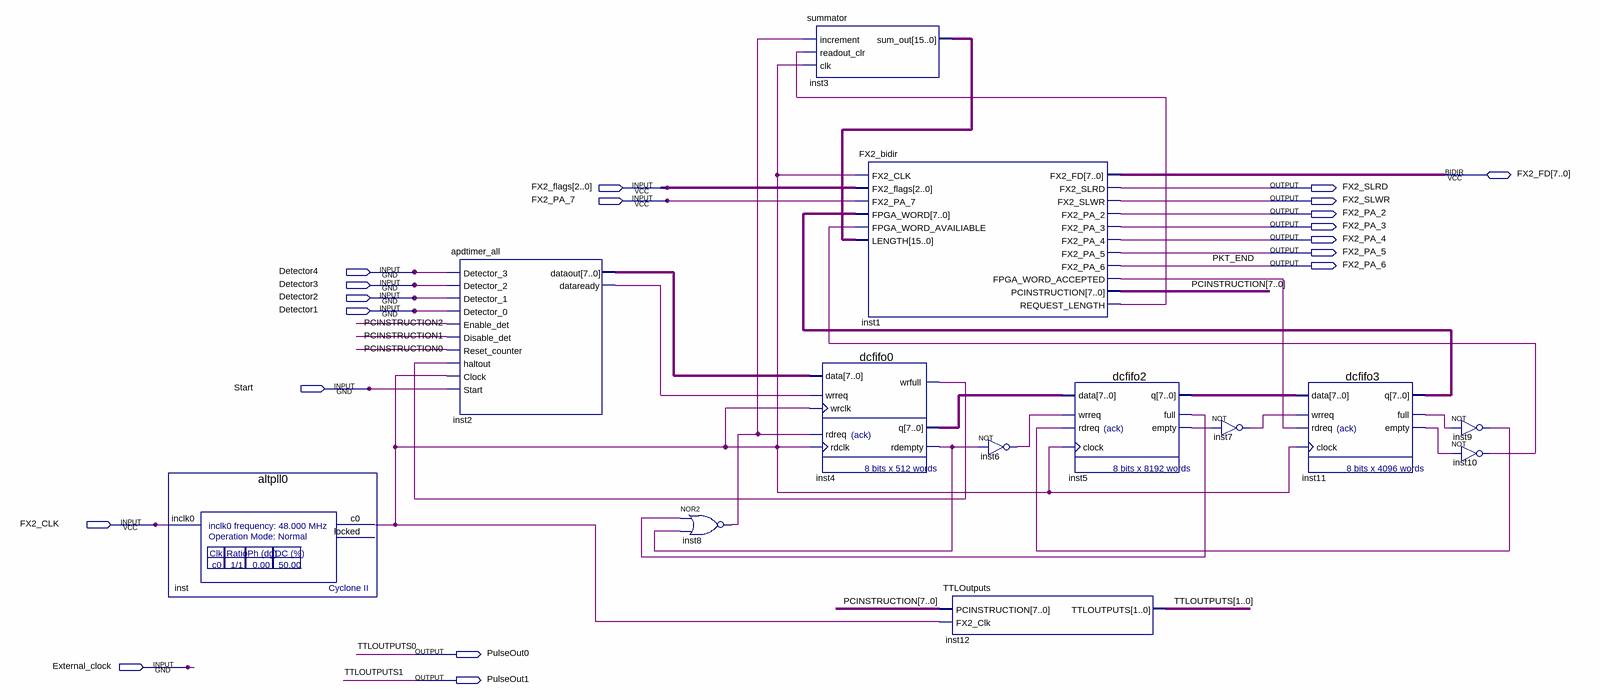
[diagram p0: schematic sheet]
// Quartus schematic testingigo_all.bdf as structural Verilog: 13 symbols, 19 pins
module testingigo_all (
  input  [2:0] FX2_flags,
  input  FX2_PA_7,
  input  Detector4,
  input  Detector3,
  input  Detector2,
  input  Detector1,
  input  Start,
  input  FX2_CLK,
  input  External_clock,
  inout  [7:0] FX2_FD,
  output FX2_SLRD,
  output FX2_SLWR,
  output FX2_PA_2,
  output FX2_PA_3,
  output FX2_PA_4,
  output FX2_PA_5,
  output FX2_PA_6,
  output PulseOut0,
  output PulseOut1
);

  wire inst1_fpga_word_accepted, inst1_request_length, inst2_dataready, inst4_rdempty, inst4_wrfull,
       inst5_empty, inst5_full, inst6_out, inst7_out, inst8_out, inst9_out, inst10_out, inst11_empty,
       inst11_full, inst_c0;
  wire [7:0] inst2_dataout, inst4_q, inst5_q, inst11_q, PCINSTRUCTION;
  wire [15:0] inst3_sum_out;

  altpll0 inst (.inclk0(FX2_CLK), .c0(inst_c0));  // open: locked
  apdtimer_all inst2 (
    .Detector_3(Detector4), .Detector_2(Detector3), .Detector_1(Detector2), .Detector_0(Detector1),
    .Reset_counter(PCINSTRUCTION[0]), .haltout(inst4_wrfull), .Clock(inst_c0), .Start(Start),
    .Enable_det(PCINSTRUCTION[2]), .Disable_det(PCINSTRUCTION[1]), .dataout(inst2_dataout),
    .dataready(inst2_dataready));
  nor inst8 (inst8_out, inst5_full, inst4_rdempty);
  summator inst3 (.increment(inst8_out), .readout_clr(inst1_request_length), .clk(inst_c0), .sum_out(inst3_sum_out));
  FX2_bidir inst1 (
    .FX2_CLK(inst_c0), .FX2_flags(FX2_flags), .FX2_PA_7(FX2_PA_7), .FPGA_WORD(inst11_q),
    .FPGA_WORD_AVAILIABLE(inst10_out), .LENGTH(inst3_sum_out), .FX2_SLRD(FX2_SLRD), .FX2_SLWR(FX2_SLWR),
    .FX2_PA_2(FX2_PA_2), .FX2_PA_3(FX2_PA_3), .FX2_PA_4(FX2_PA_4), .FX2_PA_5(FX2_PA_5), .FX2_PA_6(FX2_PA_6),
    .FPGA_WORD_ACCEPTED(inst1_fpga_word_accepted), .PCINSTRUCTION(PCINSTRUCTION),
    .REQUEST_LENGTH(inst1_request_length), .FX2_FD(FX2_FD));
  dcfifo0 inst4 (
    .data(inst2_dataout), .wrreq(inst2_dataready), .wrclk(inst_c0), .rdreq(inst8_out), .rdclk(inst_c0),
    .wrfull(inst4_wrfull), .q(inst4_q), .rdempty(inst4_rdempty));
  TTLOutputs inst12 (.PCINSTRUCTION(PCINSTRUCTION), .FX2_Clk(inst_c0), .TTLOUTPUTS({PulseOut1, PulseOut0}));
  not inst6 (inst6_out, inst4_rdempty);
  dcfifo2 inst5 (
    .data(inst4_q), .wrreq(inst6_out), .rdreq(inst9_out), .clock(inst_c0), .q(inst5_q), .full(inst5_full),
    .empty(inst5_empty));
  not inst7 (inst7_out, inst5_empty);
  dcfifo3 inst11 (
    .data(inst5_q), .wrreq(inst7_out), .rdreq(inst1_fpga_word_accepted), .clock(inst_c0), .q(inst11_q),
    .full(inst11_full), .empty(inst11_empty));
  not inst9 (inst9_out, inst11_full);
  not inst10 (inst10_out, inst11_empty);

  // Other names for the same wires on the sheet: PKT_END = FX2_PA_6; TTLOUTPUTS[1:0] = {PulseOut1, PulseOut0};
  //   TTLOUTPUTS0 = PulseOut0; TTLOUTPUTS1 = PulseOut1
endmodule
